# EAGLE design TEENSY + Sensors (EAGLE 9.6.1)
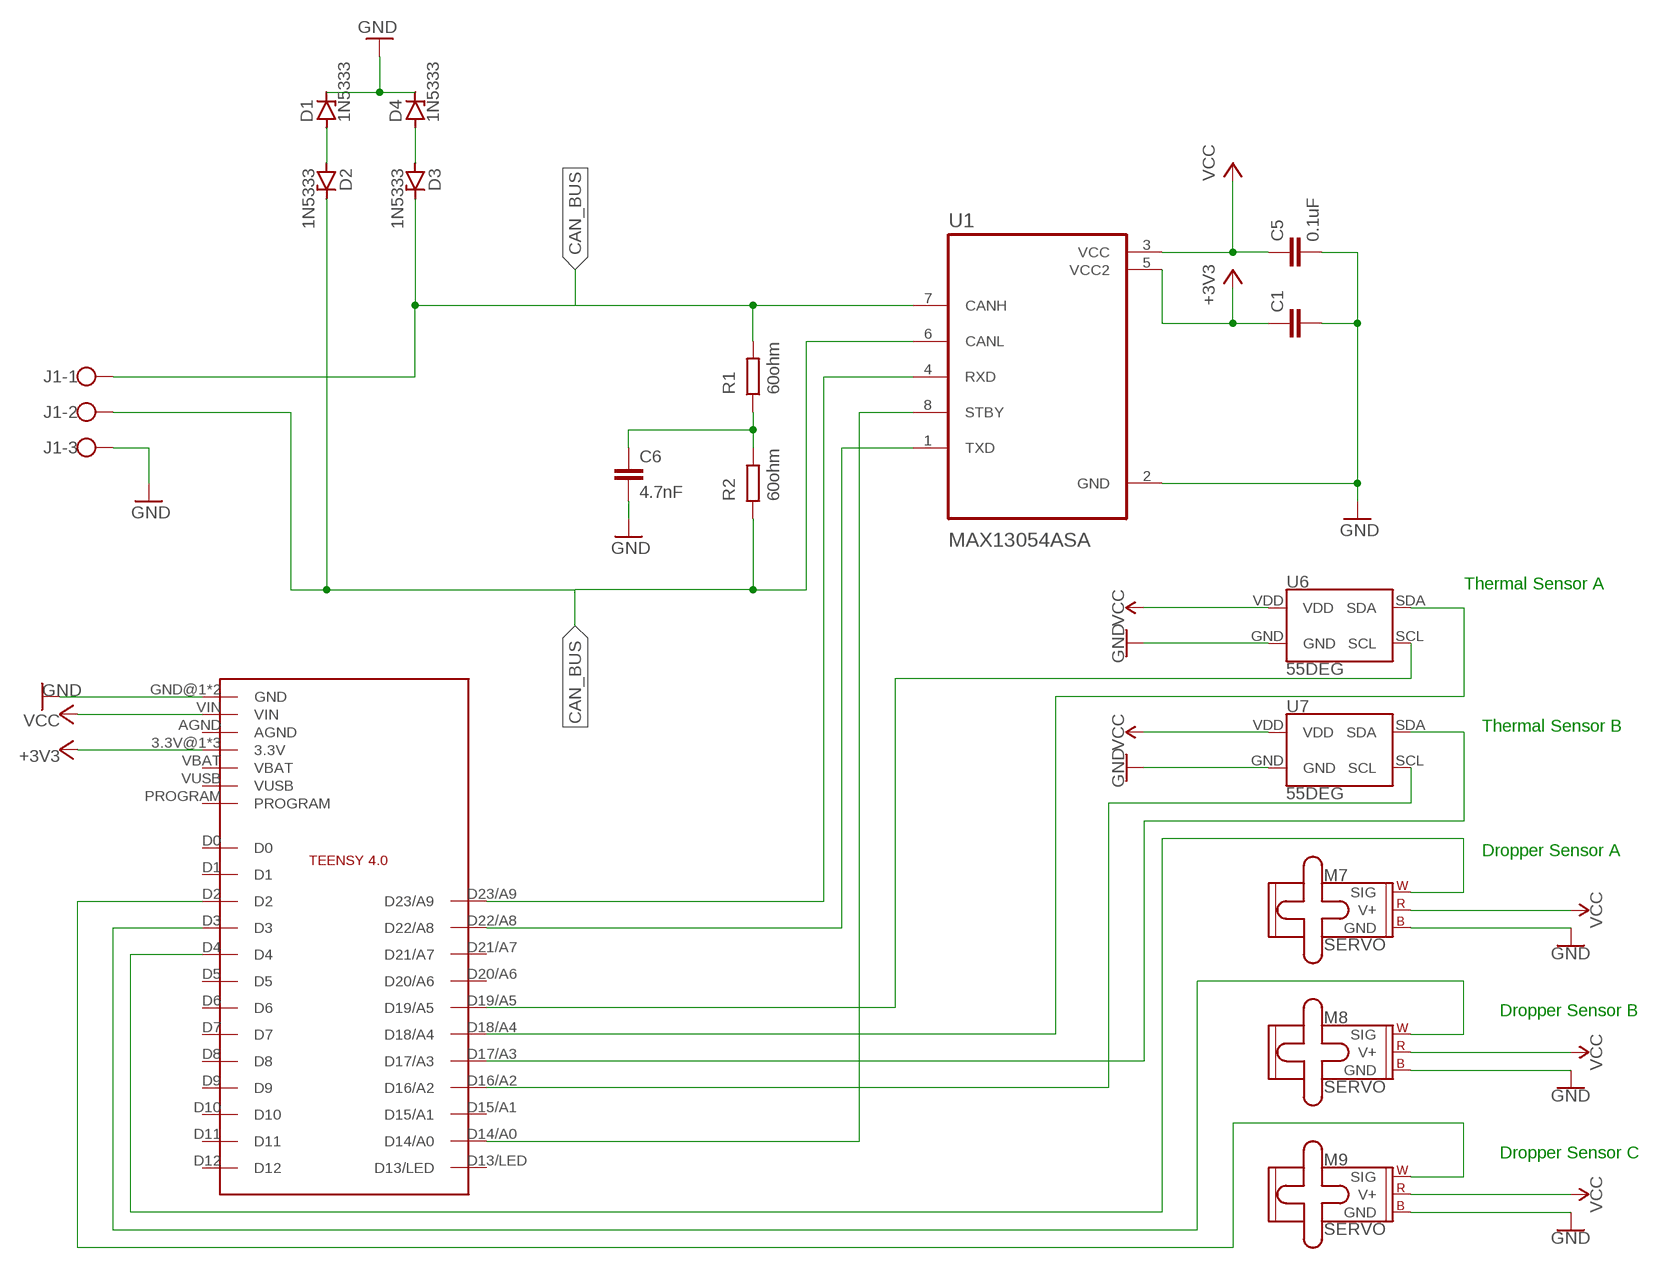
[diagram p0: schematic, sheet 1]

## Parts
C1  C2,5-3  [C2.5-3]
C5  0.1uF  C2,5-3  [C2.5-3]
C6  4.7nF  C2,5-3  [C2.5-3]
D1  1N5333  [C1702-15]
D2  1N5333  [C1702-15]
D3  1N5333  [C1702-15]
D4  1N5333  [C1702-15]
J1  W237-103  [W237-103]
M7  SERVO  [1X03]
M8  SERVO  [1X03]
M9  SERVO  [1X03]
R1  60ohm  R  (no package)
R2  60ohm  R  (no package)
U1  MAX13054ASA  [SOIC127P600X175-8N]
U6  55DEG  MLX90540_MLX90640  [MLX90540_MLX90640]
U7  55DEG  MLX90540_MLX90640  [MLX90540_MLX90640]
U$2  TEENSY4.0  [TEENSY4.0]

## Nets
+3V3: C1.1 U1.5(VCC2) U$2.3.3V@1(3.3V) U$2.3.3V@2(3.3V) U$2.ON/OFF(3.3V)
CAN_BUS: D3.C J1.1 R1.2 U1.7(CANH)
GND: C1.2 C5.2 C6.2 D1.C D4.C J1.3 M7.3(GND) M8.3(GND) M9.3(GND) U1.2(GND) U6.GND U7.GND U$2.GND@1(GND) U$2.GND@2(GND)
N$1: U1.4(RXD) U$2.D23/A9
N$2: U1.1(TXD) U$2.D22/A8
N$4: D1.A D2.A
N$5: D2.C J1.2 R2.1 U1.6(CANL)
N$6: C6.1 R1.1 R2.2
N$7: D3.A D4.A
N$46: U1.8(STBY) U$2.D14/A0
N$48: U7.SDA U$2.D17/A3
N$49: U7.SCL U$2.D16/A2
N$50: M7.1(SIG) U$2.D4
N$51: M8.1(SIG) U$2.D3
N$52: M9.1(SIG) U$2.D2
N$53: U6.SCL U$2.D19/A5
N$55: U6.SDA U$2.D18/A4
VCC: C5.1 M7.2(V+) M8.2(V+) M9.2(V+) U1.3(VCC) U6.VDD U7.VDD U$2.VIN
Unconnected: U$2.AGND U$2.D0 U$2.D1 U$2.D5 U$2.D6 U$2.D7 U$2.D8 U$2.D9 U$2.D10 U$2.D11 U$2.D12 U$2.D13/LED U$2.D15/A1 U$2.D20/A6 U$2.D21/A7 U$2.PROGRAM U$2.VBAT U$2.VUSB

## Notes on the sheet
- Thermal Sensor A
- Thermal Sensor B
- Dropper Sensor A
- Dropper Sensor B
- Dropper Sensor C

## Library data of the parts
C1 C5 C6 = capacitor-wima:C: CAPACITOR naming: grid - package width
D1-D4 = diode:1N5333: Z DIODE 3.3 V, 5W, 5 percent (Motorola)
J1 = con-wago-500:W237-103: WAGO SCREW CLAMP; MPN: 237-103; OC_FARNELL: unknown; OC_NEWARK: 18M7116
M7-M9 = SparkFun-Electromechanical:SERVO: Servo Motor 3-pin connector for a standard servo motor (voltage supply, ground, and control signal.) SparkFun Products Servo - Generic (Sub-Micro Size) <https://www.sparkfun.com/products/9065> (ROB-09065) Servo - Generic High Torque Continuous Rotation (Standard Size) <https://www.sparkfun.com/products/9347> (ROB-09347) Servo - Generic High Torque (Standard Size) <https://www.sparkfun.com/products/11965> (ROB-11965)
R1 R2 = ngspice-simulation:R: RESISTOR
U1 = MAX13054ASA:MAX13054ASA; DESCRIPTION: 1/1 Transceiver Full CANbus 8-SOIC; DIGI-KEY_PART_NUMBER: MAX13054ASA+TTR-ND; DIGI-KEY_PURCHASE_URL: https://www.digikey.com/product-detail/en/maxim-integrated/MAX13054ASA-T/MAX13054ASA-TTR-ND/1475460?utm_source=snapeda&utm_medium=aggregator&utm_campaign=symbol; MF: Maxim Integrated; MP: MAX13054ASA+; PACKAGE: SOIC-8 Maxim
U6 U7 = SparkFun-IC-Special-Function:MLX90540_MLX90640: Melexis MLX90640 Infrared Array The MLX90640 is a fully calibrated 32x24 pixels thermal IR array in an industry standard 4-lead TO39 package with digital interface.; PROD_ID: IC-14042
U$2 = Teensy4.0:TEENSY4.0

## Module RESISTER
Ports: 

### Library data of the parts

## Module GND
Ports: 

### Library data of the parts

## Module MOTOR
Ports: 

### Library data of the parts

## Module MOTORDRIVER
Ports: U(io) V(io) W(io) VCC(io) GND(io) 5V(io) GND1(io) HA(io) HB(io) HC(io) RS232(io) PWR(io) ALM(io) GND2(io) ALM1(io) X3(io) PG(io) X2(io) 5V1(io) X1(io) 5V2(io) PR(io) GND3(io) EN(io) BR(io)

### Library data of the parts

## Board
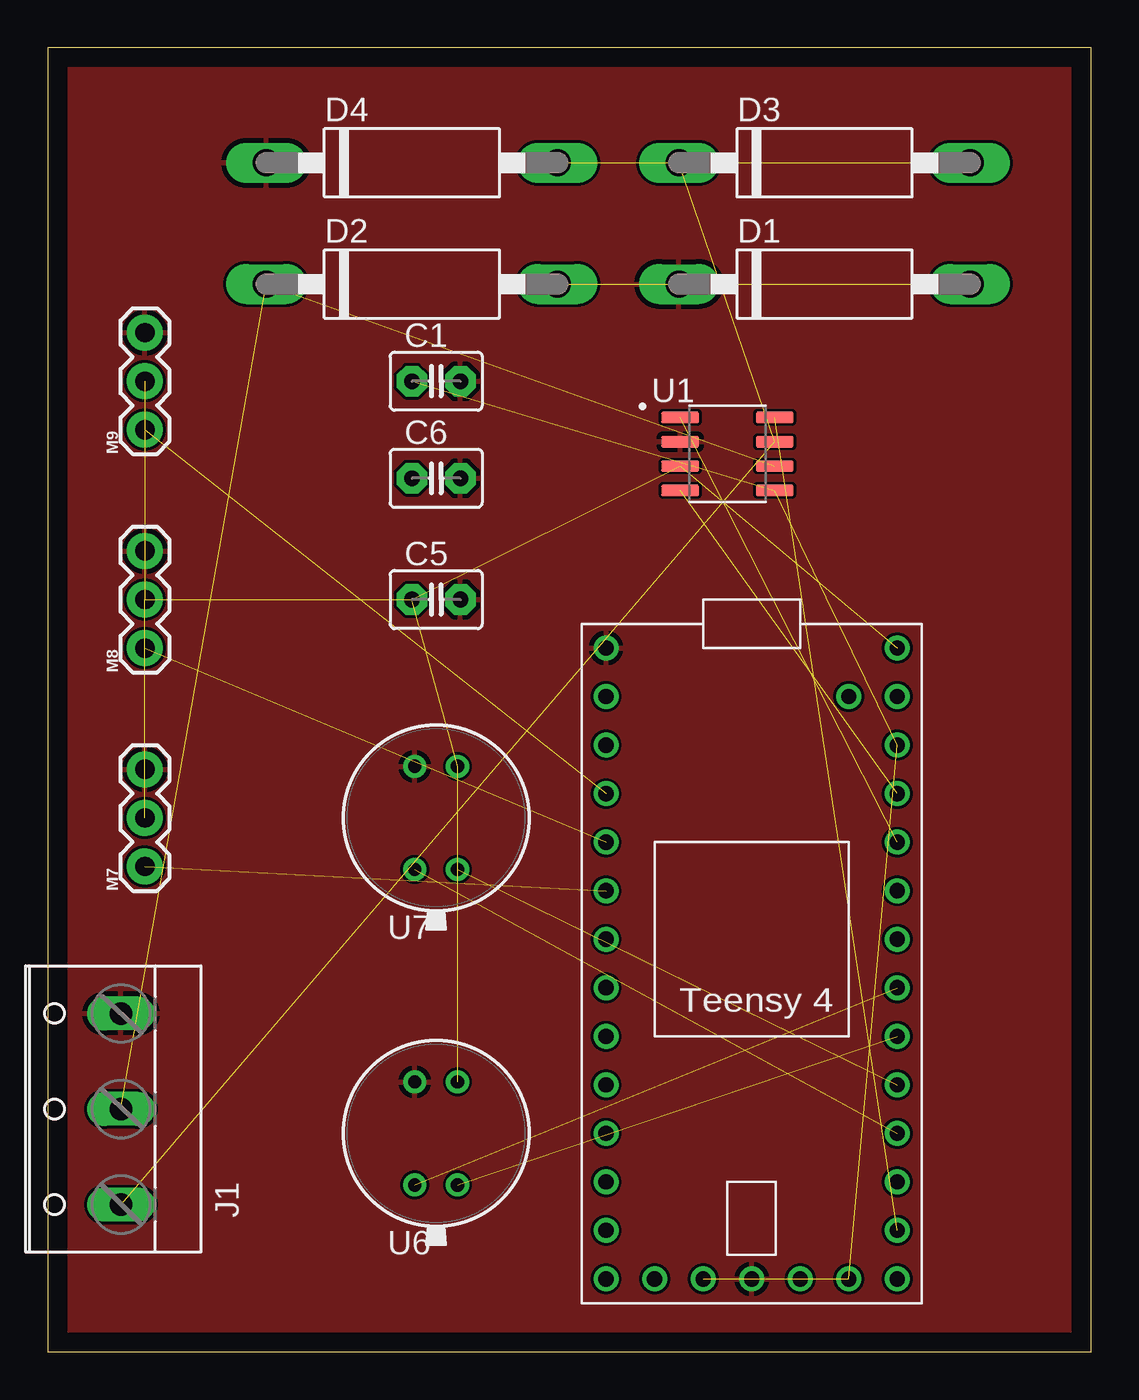
[diagram p1: board, top side]

Size 54.59 x 68.25 mm. Coordinates in mm from the lower left corner, seen from the top.
Outline: 0,0 54.59,0 54.59,68.25 0,68.25 0,0
Copper layers (1*16): Top 0.035mm / dielectric 1.5mm / Bottom 0.035mm
Design rules "default": minimum track width 6mil, minimum drill 0.35mm, track to track 6mil, track to pad 6mil, pad to pad 6mil, via to via 6mil, smd to smd 6mil, copper to edge 40mil, drill to drill 6mil, minimum pad ring 10mil, minimum via ring 8mil, stop-mask expansion 4mil, vias tented up to drill 0mil, thermal gap 10mil

### Footprints (pad centres in the part's own frame; a part is rotated, then mirrored left to right if it is on the bottom)
C2.5-3 = drill 0.813 pad 1.6 octagon: 1 -1.27,0; 2 1.27,0
C1702-15 = drill 1.397 long: A 7.62,0; C -7.62,0
W237-103 = drill 1.194 long: 1 -5,-1.29; 2 0,-1.29; 3 5,-1.29
1X03 = drill 1.016 pad 1.88: 1 0,0; 2 2.54,0; 3 5.08,0
SOIC127P600X175-8N = smd 1.97 x 0.59: 1 -2.475,1.905; 2 -2.475,0.635; 3 -2.475,-0.635; 4 -2.475,-1.905; 5 2.475,-1.905; 6 2.475,-0.635; 7 2.475,0.635; 8 2.475,1.905
MLX90540_MLX90640 = drill 0.7: GND -1.117,2.698; SCL -1.117,-2.698; SDA 1.117,-2.698; VDD 1.117,2.698
TEENSY4.0 = drill 0.8: 3.3V@1 7.62,10.16; 3.3V@2 -2.54,-17.78; AGND 7.62,12.7; D0 -7.62,12.7; D1 -7.62,10.16; D2 -7.62,7.62; D3 -7.62,5.08; D4 -7.62,2.54; D5 -7.62,0; D6 -7.62,-2.54; D7 -7.62,-5.08; D8 -7.62,-7.62; D9 -7.62,-10.16; D10 -7.62,-12.7; D11 -7.62,-15.24; D12 -7.62,-17.78; D13/LED 7.62,-17.78; D14/A0 7.62,-15.24; D15/A1 7.62,-12.7; D16/A2 7.62,-10.16; D17/A3 7.62,-7.62; D18/A4 7.62,-5.08; D19/A5 7.62,-2.54; D20/A6 7.62,0; D21/A7 7.62,2.54; D22/A8 7.62,5.08; D23/A9 7.62,7.62; GND@1 -7.62,15.24; GND@2 0,-17.78; ON/OFF 5.08,-17.78; PROGRAM 2.54,-17.78; VBAT -5.08,-17.78; VIN 7.62,15.24; VUSB 5.08,12.7

### Placement (x,y rotation side)
C1  20.32,50.8 0 top
C5  20.32,39.37 0 top
C6  20.32,45.72 0 top
D1  40.64,55.88 0 top
D2  19.05,55.88 0 top
D3  40.64,62.23 0 top
D4  19.05,62.23 0 top
J1  2.54,12.7 90 top
M7  5.08,25.4 90 top
M8  5.08,36.83 90 top
M9  5.08,48.26 90 top
U1  35.56,46.99 0 top
U6  20.32,11.43 0 top
U7  20.32,27.94 0 top
U$2  36.83,21.59 0 top

### Tracks (layer width: path | path; a pad name or v marks a point on that pad's centre or on a via)
+3V3  (4 unrouted)
CAN_BUS  (2 unrouted)
GND
  pour Top: -1.27,69.85 -1.27,-1.27 55.88,-1.27 55.88,69.85
N$1  (1 unrouted)
N$2  (1 unrouted)
N$4  (1 unrouted)
N$5  (2 unrouted)
N$7  (1 unrouted)
N$46  (1 unrouted)
N$48  (1 unrouted)
N$49  (1 unrouted)
N$50  (1 unrouted)
N$51  (1 unrouted)
N$52  (1 unrouted)
N$53  (1 unrouted)
N$55  (1 unrouted)
VCC  (7 unrouted)